# EAGLE design fabflash-mk-2-booster (EAGLE 6.5.0)
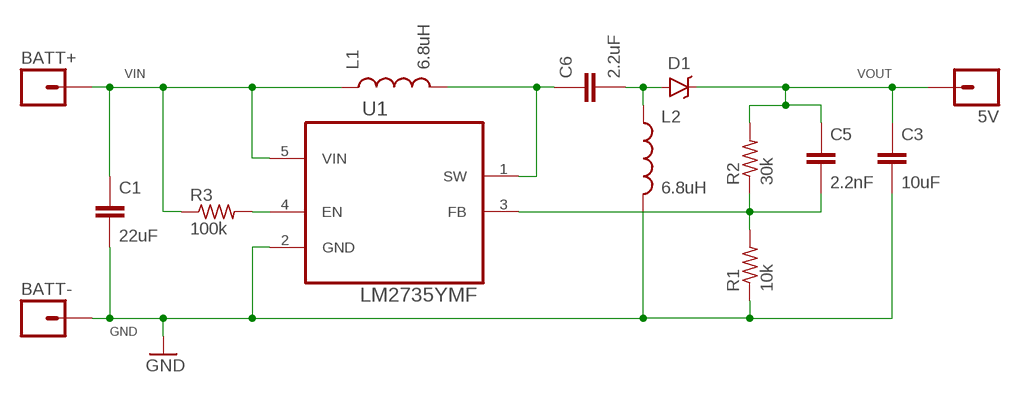
[diagram p0: schematic, sheet 1]

## Parts
5V  M01PTH-1.2MM  [1X01-1.2MM]
BATT+  M01NOT-A-VIA-NOPE  [1X01_NOSILK_NOSTOP]
BATT-  M01NOT-A-VIA-NOPE  [1X01_NOSILK_NOSTOP]
C1  22uF  CAPACITOR-CERAMICC0805  [C0805]
C3  10uF  CAPACITOR-CERAMICC0805  [C0805]
C5  2.2nF  CAPACITOR-CERAMICC0805  [C0805]
C6  2.2uF  CAPACITOR-CERAMICC0805  [C0805]
D1  B340A  DIODE-SCHOTTKYB340A  [SMA-DIODE]
L1  6.8uH  INDUCTORTAIYO-YUDEN-40XX  [TAIYO-YUDEN-40XX]
L2  6.8uH  INDUCTORTAIYO-YUDEN-40XX  [TAIYO-YUDEN-40XX]
R1  10k  RESISTORR0805  [R0805]
R2  30k  RESISTORR0805  [R0805]
R3  100k  RESISTORR0805  [R0805]
U1  LM2735YMF  [SOT95P285X110-5N]

## Nets
GND: BATT-.P$1 C1.2 C3.2 L2.2 R1.1 U1.2(GND)
N$1: C6.1 L1.2 U1.1(SW)
N$2: R3.2 U1.4(EN)
N$6: C6.2 D1.A L2.1
N$8: C5.2 R1.2 R2.1 U1.3(FB)
VIN: BATT+.P$1 C1.1 L1.1 R3.1 U1.5(VIN)
VOUT: 5V.P$1 C3.1 C5.1 D1.C R2.2

## Library data of the parts
5V BATT+ BATT- = A_butts:M01: Header 1 Standard 1-pin 0.1" header. Use with straight break away headers (SKU : PRT-00116), right angle break away headers (PRT-00553), swiss pins (PRT-00743), machine pins (PRT-00117), and female headers (PRT-00115).
C1 C3 C5 C6 = A_butts:CAPACITOR-CERAMIC: CAPACITOR, European symbol
D1 = A_butts:DIODE-SCHOTTKY: Schottky diodes in SFE's production catalog BAT20J 1A 23V 0.62Vf RB751 120mA 40V 0.37Vf PMEG4005EJ 0.5A 40V 0.42Vf MBRA140 1A 40V 0.5Vf B340A 3A 40V SMA; PROD_ID: DIO-09886
L1 L2 = A_butts:INDUCTOR: Inductors Basic Inductor/Choke - 0603 and 1206. Footprints are not proven and vary greatly between part numbers. SRN6045- 33uH, 20% 1.4A SDR0403-560KL - 56uH, 10%, 500mA RMS/740mA peak
R1-R3 = A_butts:RESISTOR: RESISTOR, American symbol
U1 = A_butts:LM2735YMF: IC BOOST SEPIC ADJ 2.1A; MPN: LM2735YMF; OC_FARNELL: 1426509; OC_NEWARK: 50M8801; PACKAGE: SOT23-5; SUPPLIER: National Semiconductor

## Board
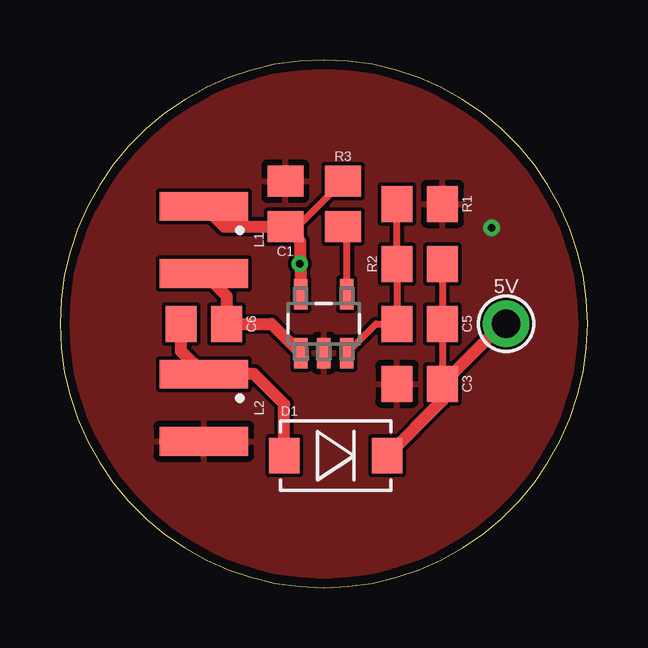
[diagram p1: board, top side]
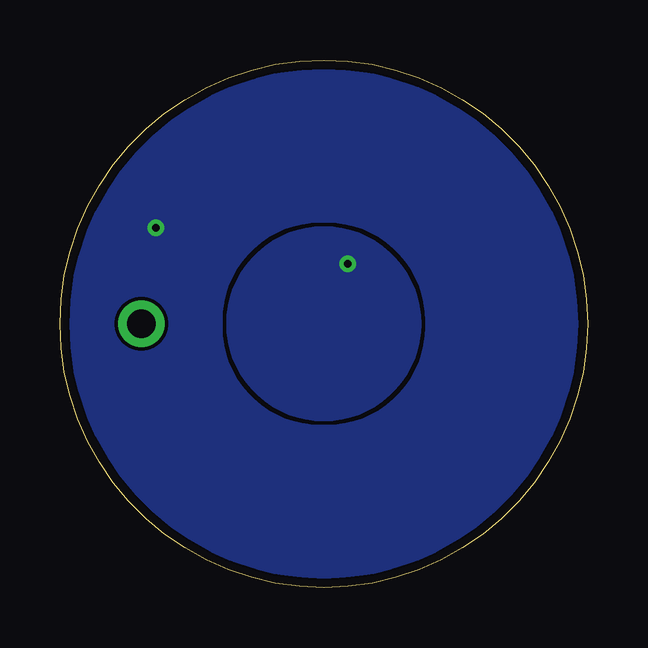
[diagram p2: board, bottom side, seen from below]

Size 22 x 22 mm. Coordinates in mm from the lower left corner, seen from the top.
Outline: 0,11 arc90 11,0 arc90 22,11 arc90 11,22 arc90 0,11
Copper layers (1*16): Top 0.0356mm / dielectric 1.5011mm / Bottom 0.0356mm
Design rules "LaenPCBOrder2": minimum track width 6mil, minimum drill 13mil, track to track 6mil, track to pad 6mil, pad to pad 6mil, via to via 6mil, smd to smd 6mil, copper to edge 15mil, drill to drill 6mil, minimum pad ring 7mil, minimum via ring 7mil, stop-mask expansion 3mil, vias tented up to drill 20mil, thermal gap 10mil

### Footprints (pad centres in the part's own frame; a part is rotated, then mirrored left to right if it is on the bottom)
1X01-1.2MM = drill 1.2 pad 1.93: P$1 0,0
1X01_NOSILK_NOSTOP = drill 0.33: P$1 0,0
C0805 = smd 1.3 x 1.5: 1 -0.95,0; 2 0.95,0
SMA-DIODE = smd 1.27 x 1.47: A -2.15,0; C 2.15,0
TAIYO-YUDEN-40XX = smd 1.2 x 3.7: 1 -1.4,0; 2 1.4,0
R0805 = smd 1.3 x 1.5: 1 -0.95,0; 2 0.95,0
SOT95P285X110-5N = smd 1.27 x 0.559: 1 -1.219,0.965; 2 -1.219,0; 3 -1.219,-0.965; 4 1.219,-0.965; 5 1.219,0.965

### Placement (x,y rotation side)
5V  18.6,11 0 top
BATT+  10,13.5 0 top
BATT-  18,15 0 top
C1  9.4,16 90 top
C3  15,8.5 180 top
C5  15,11 180 top
C6  6,11 180 top
D1  11.5,5.5 0 top
L1  6,14.5 270 top
L2  6,7.5 270 top
R1  15,16 180 top
R2  15,13.5 0 top
R3  11.8,16 270 top
U1  11,11 90 top

### Tracks (layer width: path | path; a pad name or v marks a point on that pad's centre or on a via)
GND
  pour Top (rank 6): 11,0 arc-90 0,11 arc-90 11,22 arc-90 22,11 arc-90
  pour Bottom (rank 6): 11,0 arc-90 0,11 arc-90 11,22 arc-90 22,11 arc-90
N$1
  Top 0.5: L1.2 6.95,12.15 C6.1 8.82,11 U1.1
N$2
  Top 0.3: U1.4 11.96,14.79
  Top 0.406: 11.96,14.79 R3.2
N$6
  Top 0.5: C6.2 5.05,9.85 L2.1 8.1,8.9 9.35,7.65 D1.A
N$8
  Top 0.3: U1.3 13.18,11 C5.2 R2.1 R1.2
VIN
  Top 0.3: R3.1 9.9,15.05 C1.1
  Top 0.5: U1.5 10.04,13.5 BATT+.P$1 10,14.45 C1.1 6.85,15.05 L1.1
  pour Bottom: 11,7 arc-90 7,11 arc-90 11,15 arc-90 15,11 arc-90
VOUT
  Top 0.3: C3.1 C5.1 R2.2
  Top 0.5: D1.C 15.95,7.8 C3.1 18.45,11 5V.P$1